# Altium project IV_A_Boost_To_SMU_Board.PrjPcb
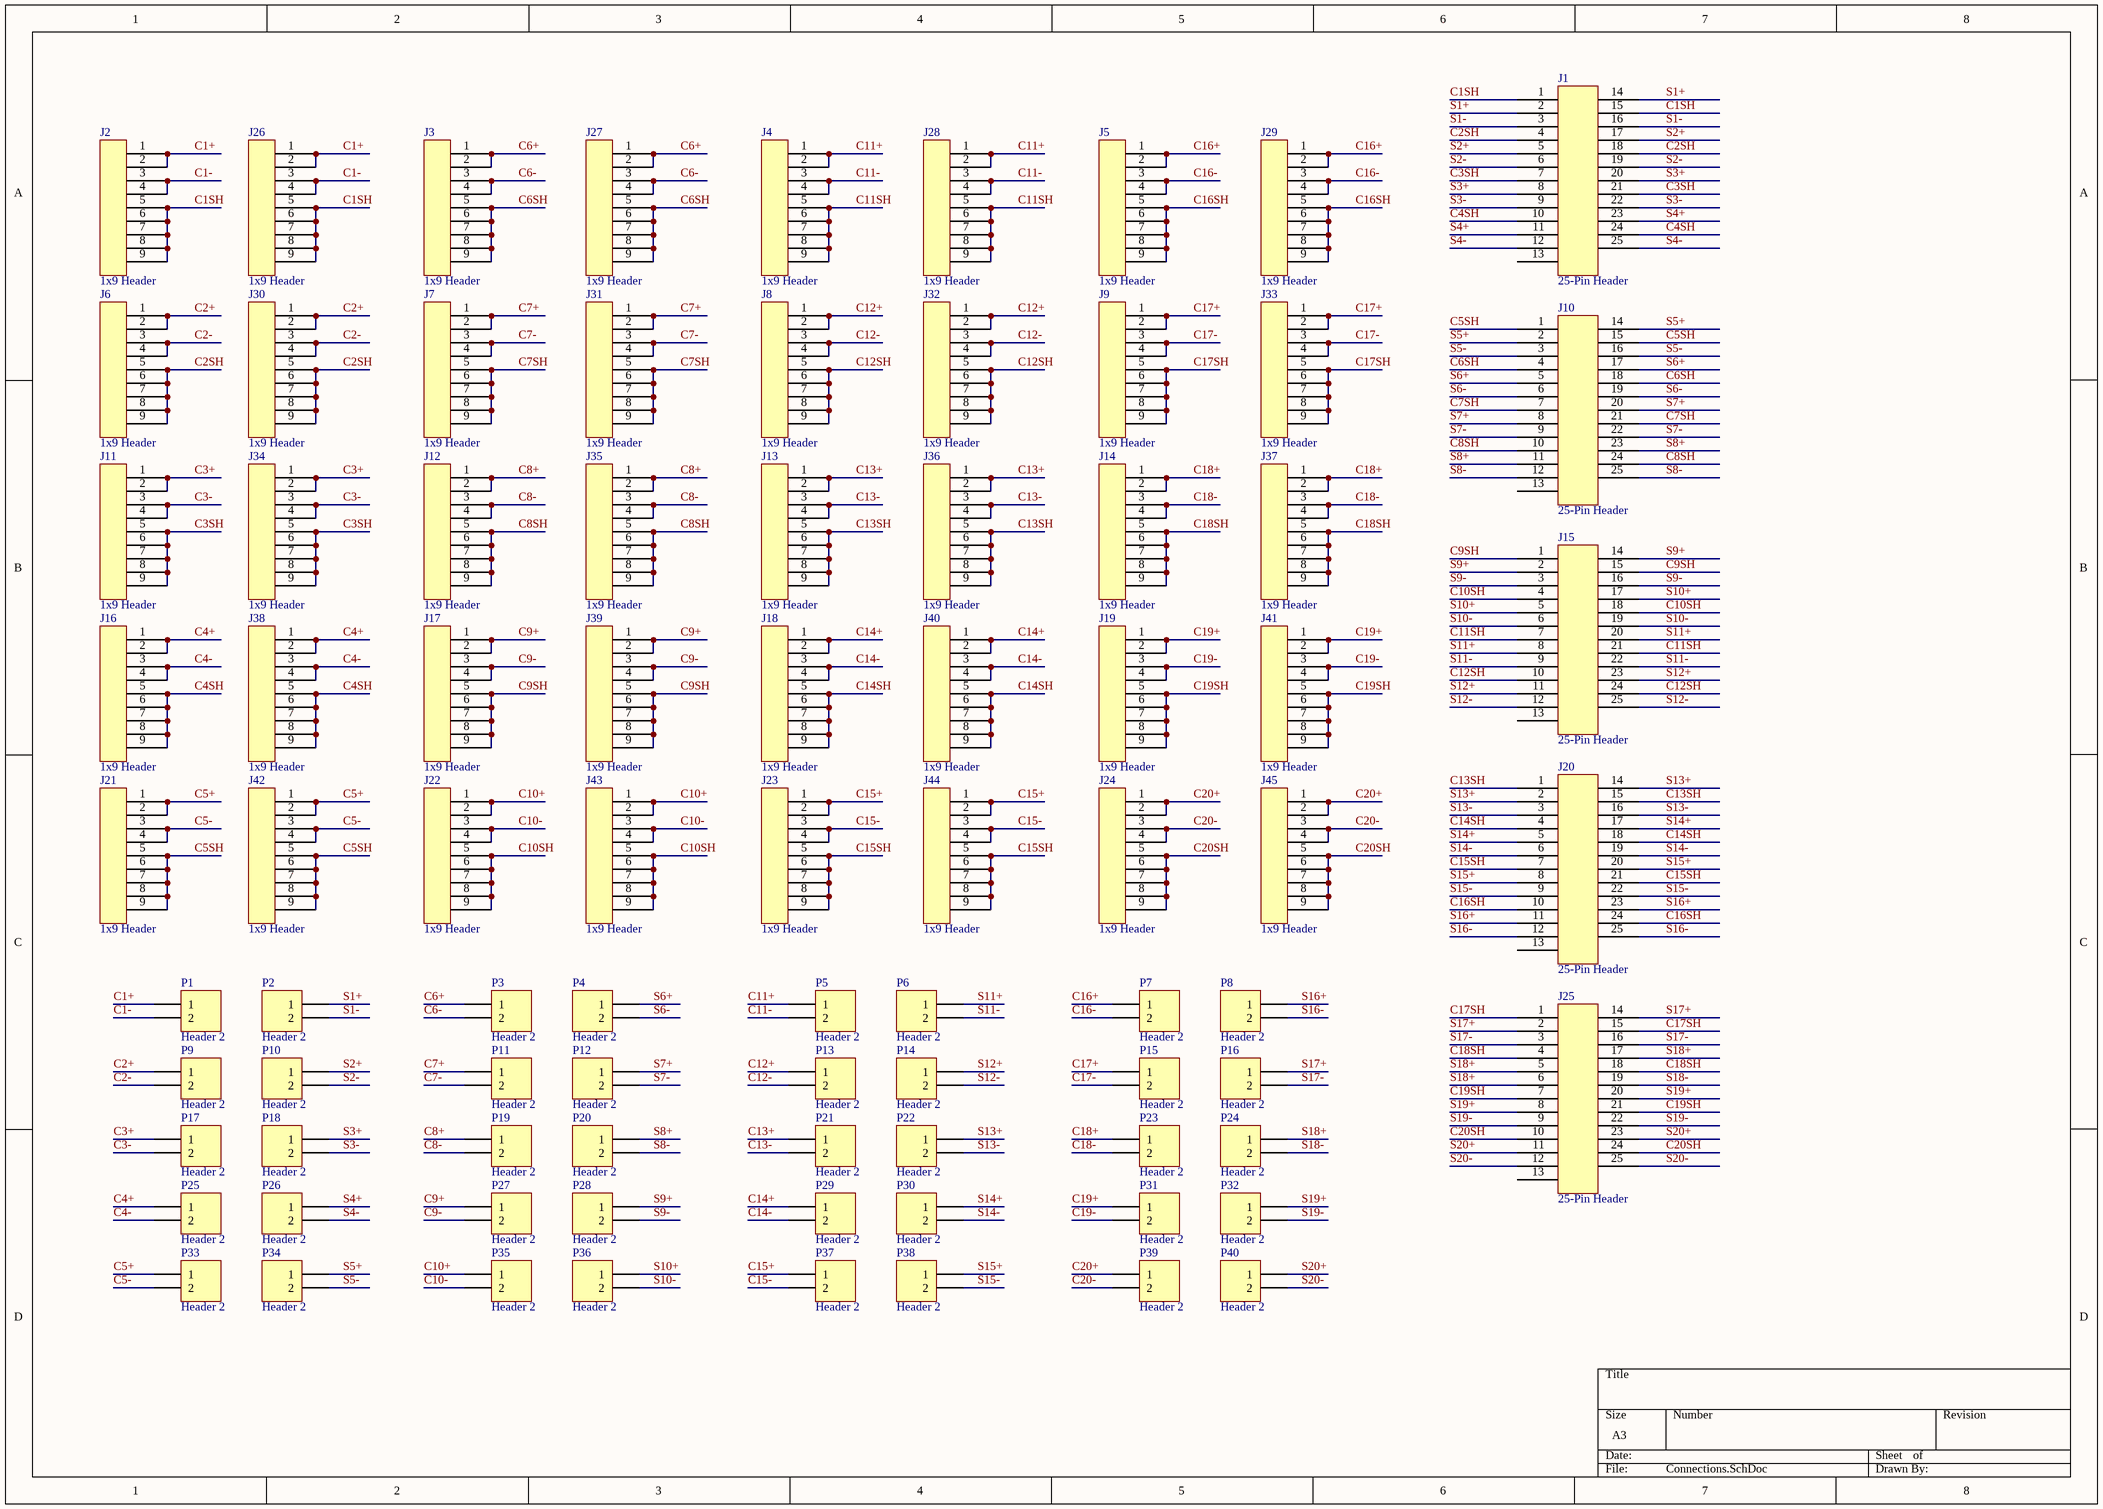
[diagram p0: Connections.SchDoc]
1 sheet, 85 parts. Net scope: global (net labels, ports and power ports of the same name join across sheets).
Board file: 6C-2L-1550um.PcbDoc

## Sheet Connections.SchDoc
size A3; SheetNumber: 1; SheetTotal: 1

### Parts
J1  25-Pin Header  [25-DSub-Rightangle-Female]
J2  1x9 Header  [D-SUB-9PIN-TE]
J3  1x9 Header  [D-SUB-9PIN-TE]
J4  1x9 Header  [D-SUB-9PIN-TE]
J5  1x9 Header  [D-SUB-9PIN-TE]
J6  1x9 Header  [D-SUB-9PIN-TE]
J7  1x9 Header  [D-SUB-9PIN-TE]
J8  1x9 Header  [D-SUB-9PIN-TE]
J9  1x9 Header  [D-SUB-9PIN-TE]
J10  25-Pin Header  [25-DSub-Rightangle-Female]
J11  1x9 Header  [D-SUB-9PIN-TE]
J12  1x9 Header  [D-SUB-9PIN-TE]
J13  1x9 Header  [D-SUB-9PIN-TE]
J14  1x9 Header  [D-SUB-9PIN-TE]
J15  25-Pin Header  [25-DSub-Rightangle-Female]
J16  1x9 Header  [D-SUB-9PIN-TE]
J17  1x9 Header  [D-SUB-9PIN-TE]
J18  1x9 Header  [D-SUB-9PIN-TE]
J19  1x9 Header  [D-SUB-9PIN-TE]
J20  25-Pin Header  [25-DSub-Rightangle-Female]
J21  1x9 Header  [D-SUB-9PIN-TE]
J22  1x9 Header  [D-SUB-9PIN-TE]
J23  1x9 Header  [D-SUB-9PIN-TE]
J24  1x9 Header  [D-SUB-9PIN-TE]
J25  25-Pin Header  [25-DSub-Rightangle-Female]
J26  1x9 Header  [D-SUB-9PIN-TE]
J27  1x9 Header  [D-SUB-9PIN-TE]
J28  1x9 Header  [D-SUB-9PIN-TE]
J29  1x9 Header  [D-SUB-9PIN-TE]
J30  1x9 Header  [D-SUB-9PIN-TE]
J31  1x9 Header  [D-SUB-9PIN-TE]
J32  1x9 Header  [D-SUB-9PIN-TE]
J33  1x9 Header  [D-SUB-9PIN-TE]
J34  1x9 Header  [D-SUB-9PIN-TE]
J35  1x9 Header  [D-SUB-9PIN-TE]
J36  1x9 Header  [D-SUB-9PIN-TE]
J37  1x9 Header  [D-SUB-9PIN-TE]
J38  1x9 Header  [D-SUB-9PIN-TE]
J39  1x9 Header  [D-SUB-9PIN-TE]
J40  1x9 Header  [D-SUB-9PIN-TE]
J41  1x9 Header  [D-SUB-9PIN-TE]
J42  1x9 Header  [D-SUB-9PIN-TE]
J43  1x9 Header  [D-SUB-9PIN-TE]
J44  1x9 Header  [D-SUB-9PIN-TE]
J45  1x9 Header  [D-SUB-9PIN-TE]
P1  Header 2  [HDR1X2]
P2  Header 2  [HDR1X2]
P3  Header 2  [HDR1X2]
P4  Header 2  [HDR1X2]
P5  Header 2  [HDR1X2]
P6  Header 2  [HDR1X2]
P7  Header 2  [HDR1X2]
P8  Header 2  [HDR1X2]
P9  Header 2  [HDR1X2]
P10  Header 2  [HDR1X2]
P11  Header 2  [HDR1X2]
P12  Header 2  [HDR1X2]
P13  Header 2  [HDR1X2]
P14  Header 2  [HDR1X2]
P15  Header 2  [HDR1X2]
P16  Header 2  [HDR1X2]
P17  Header 2  [HDR1X2]
P18  Header 2  [HDR1X2]
P19  Header 2  [HDR1X2]
P20  Header 2  [HDR1X2]
P21  Header 2  [HDR1X2]
P22  Header 2  [HDR1X2]
P23  Header 2  [HDR1X2]
P24  Header 2  [HDR1X2]
P25  Header 2  [HDR1X2]
P26  Header 2  [HDR1X2]
P27  Header 2  [HDR1X2]
P28  Header 2  [HDR1X2]
P29  Header 2  [HDR1X2]
P30  Header 2  [HDR1X2]
P31  Header 2  [HDR1X2]
P32  Header 2  [HDR1X2]
P33  Header 2  [HDR1X2]
P34  Header 2  [HDR1X2]
P35  Header 2  [HDR1X2]
P36  Header 2  [HDR1X2]
P37  Header 2  [HDR1X2]
P38  Header 2  [HDR1X2]
P39  Header 2  [HDR1X2]
P40  Header 2  [HDR1X2]

### Nets
C1+: J2.1 J2.2 J26.1 J26.2 P1.1
C1-: J2.3 J2.4 J26.3 J26.4 P1.2
C1SH: J1.1 J1.15 J2.5 J2.6 J2.7 J2.8 J2.9 J26.5 J26.6 J26.7 J26.8 J26.9
C2+: J6.1 J6.2 J30.1 J30.2 P9.1
C2-: J6.3 J6.4 J30.3 J30.4 P9.2
C2SH: J1.4 J1.18 J6.5 J6.6 J6.7 J6.8 J6.9 J30.5 J30.6 J30.7 J30.8 J30.9
C3+: J11.1 J11.2 J34.1 J34.2 P17.1
C3-: J11.3 J11.4 J34.3 J34.4 P17.2
C3SH: J1.7 J1.21 J11.5 J11.6 J11.7 J11.8 J11.9 J34.5 J34.6 J34.7 J34.8 J34.9
C4+: J16.1 J16.2 J38.1 J38.2 P25.1
C4-: J16.3 J16.4 J38.3 J38.4 P25.2
C4SH: J1.10 J1.24 J16.5 J16.6 J16.7 J16.8 J16.9 J38.5 J38.6 J38.7 J38.8 J38.9
C5+: J21.1 J21.2 J42.1 J42.2 P33.1
C5-: J21.3 J21.4 J42.3 J42.4 P33.2
C5SH: J10.1 J10.15 J21.5 J21.6 J21.7 J21.8 J21.9 J42.5 J42.6 J42.7 J42.8 J42.9
C6+: J3.1 J3.2 J27.1 J27.2 P3.1
C6-: J3.3 J3.4 J27.3 J27.4 P3.2
C6SH: J3.5 J3.6 J3.7 J3.8 J3.9 J10.4 J10.18 J27.5 J27.6 J27.7 J27.8 J27.9
C7+: J7.1 J7.2 J31.1 J31.2 P11.1
C7-: J7.3 J7.4 J31.3 J31.4 P11.2
C7SH: J7.5 J7.6 J7.7 J7.8 J7.9 J10.7 J10.21 J31.5 J31.6 J31.7 J31.8 J31.9
C8+: J12.1 J12.2 J35.1 J35.2 P19.1
C8-: J12.3 J12.4 J35.3 J35.4 P19.2
C8SH: J10.10 J10.24 J12.5 J12.6 J12.7 J12.8 J12.9 J35.5 J35.6 J35.7 J35.8 J35.9
C9+: J17.1 J17.2 J39.1 J39.2 P27.1
C9-: J17.3 J17.4 J39.3 J39.4 P27.2
C9SH: J15.1 J15.15 J17.5 J17.6 J17.7 J17.8 J17.9 J39.5 J39.6 J39.7 J39.8 J39.9
C10+: J22.1 J22.2 J43.1 J43.2 P35.1
C10-: J22.3 J22.4 J43.3 J43.4 P35.2
C10SH: J15.4 J15.18 J22.5 J22.6 J22.7 J22.8 J22.9 J43.5 J43.6 J43.7 J43.8 J43.9
C11+: J4.1 J4.2 J28.1 J28.2 P5.1
C11-: J4.3 J4.4 J28.3 J28.4 P5.2
C11SH: J4.5 J4.6 J4.7 J4.8 J4.9 J15.7 J15.21 J28.5 J28.6 J28.7 J28.8 J28.9
C12+: J8.1 J8.2 J32.1 J32.2 P13.1
C12-: J8.3 J8.4 J32.3 J32.4 P13.2
C12SH: J8.5 J8.6 J8.7 J8.8 J8.9 J15.10 J15.24 J32.5 J32.6 J32.7 J32.8 J32.9
C13+: J13.1 J13.2 J36.1 J36.2 P21.1
C13-: J13.3 J13.4 J36.3 J36.4 P21.2
C13SH: J13.5 J13.6 J13.7 J13.8 J13.9 J20.1 J20.15 J36.5 J36.6 J36.7 J36.8 J36.9
C14+: J18.1 J18.2 J40.1 J40.2 P29.1
C14-: J18.3 J18.4 J40.3 J40.4 P29.2
C14SH: J18.5 J18.6 J18.7 J18.8 J18.9 J20.4 J20.18 J40.5 J40.6 J40.7 J40.8 J40.9
C15+: J23.1 J23.2 J44.1 J44.2 P37.1
C15-: J23.3 J23.4 J44.3 J44.4 P37.2
C15SH: J20.7 J20.21 J23.5 J23.6 J23.7 J23.8 J23.9 J44.5 J44.6 J44.7 J44.8 J44.9
C16+: J5.1 J5.2 J29.1 J29.2 P7.1
C16-: J5.3 J5.4 J29.3 J29.4 P7.2
C16SH: J5.5 J5.6 J5.7 J5.8 J5.9 J20.10 J20.24 J29.5 J29.6 J29.7 J29.8 J29.9
C17+: J9.1 J9.2 J33.1 J33.2 P15.1
C17-: J9.3 J9.4 J33.3 J33.4 P15.2
C17SH: J9.5 J9.6 J9.7 J9.8 J9.9 J25.1 J25.15 J33.5 J33.6 J33.7 J33.8 J33.9
C18+: J14.1 J14.2 J37.1 J37.2 P23.1
C18-: J14.3 J14.4 J37.3 J37.4 P23.2
C18SH: J14.5 J14.6 J14.7 J14.8 J14.9 J25.4 J25.18 J37.5 J37.6 J37.7 J37.8 J37.9
C19+: J19.1 J19.2 J41.1 J41.2 P31.1
C19-: J19.3 J19.4 J41.3 J41.4 P31.2
C19SH: J19.5 J19.6 J19.7 J19.8 J19.9 J25.7 J25.21 J41.5 J41.6 J41.7 J41.8 J41.9
C20+: J24.1 J24.2 J45.1 J45.2 P39.1
C20-: J24.3 J24.4 J45.3 J45.4 P39.2
C20SH: J24.5 J24.6 J24.7 J24.8 J24.9 J25.10 J25.24 J45.5 J45.6 J45.7 J45.8 J45.9
S1+: J1.2 J1.14 P2.1
S1-: J1.3 J1.16 P2.2
S2+: J1.5 J1.17 P10.1
S2-: J1.6 J1.19 P10.2
S3+: J1.8 J1.20 P18.1
S3-: J1.9 J1.22 P18.2
S4+: J1.11 J1.23 P26.1
S4-: J1.12 J1.25 P26.2
S5+: J10.2 J10.14 P34.1
S5-: J10.3 J10.16 P34.2
S6+: J10.5 J10.17 P4.1
S6-: J10.6 J10.19 P4.2
S7+: J10.8 J10.20 P12.1
S7-: J10.9 J10.22 P12.2
S8+: J10.11 J10.23 P20.1
S8-: J10.12 J10.25 P20.2
S9+: J15.2 J15.14 P28.1
S9-: J15.3 J15.16 P28.2
S10+: J15.5 J15.17 P36.1
S10-: J15.6 J15.19 P36.2
S11+: J15.8 J15.20 P6.1
S11-: J15.9 J15.22 P6.2
S12+: J15.11 J15.23 P14.1
S12-: J15.12 J15.25 P14.2
S13+: J20.2 J20.14 P22.1
S13-: J20.3 J20.16 P22.2
S14+: J20.5 J20.17 P30.1
S14-: J20.6 J20.19 P30.2
S15+: J20.8 J20.20 P38.1
S15-: J20.9 J20.22 P38.2
S16+: J20.11 J20.23 P8.1
S16-: J20.12 J20.25 P8.2
S17+: J25.2 J25.14 P16.1
S17-: J25.3 J25.16 P16.2
S18+: J25.5 J25.6 J25.17 P24.1
S18-: J25.19 P24.2
S19+: J25.8 J25.20 P32.1
S19-: J25.9 J25.22 P32.2
S20+: J25.11 J25.23 P40.1
S20-: J25.12 J25.25 P40.2

Not connected (* = marked no-connect by the designer): J1 13; J10 13; J15 13; J20 13; J25 13

### Library data of the parts
J1 J10 J15 J20 J25 = 25-Pin Header: 25-Pin Header DSub
P1-P40 = Header 2: Header, 2-Pin; LatestRevisionDate: 17-Jul-2002; LatestRevisionNote: Re-released for DXP Platform.; Publisher: Altium Limited